# Altium schematic sheet Slave1.SchDoc
size A4; SheetNumber: 5; SheetTotal: 8
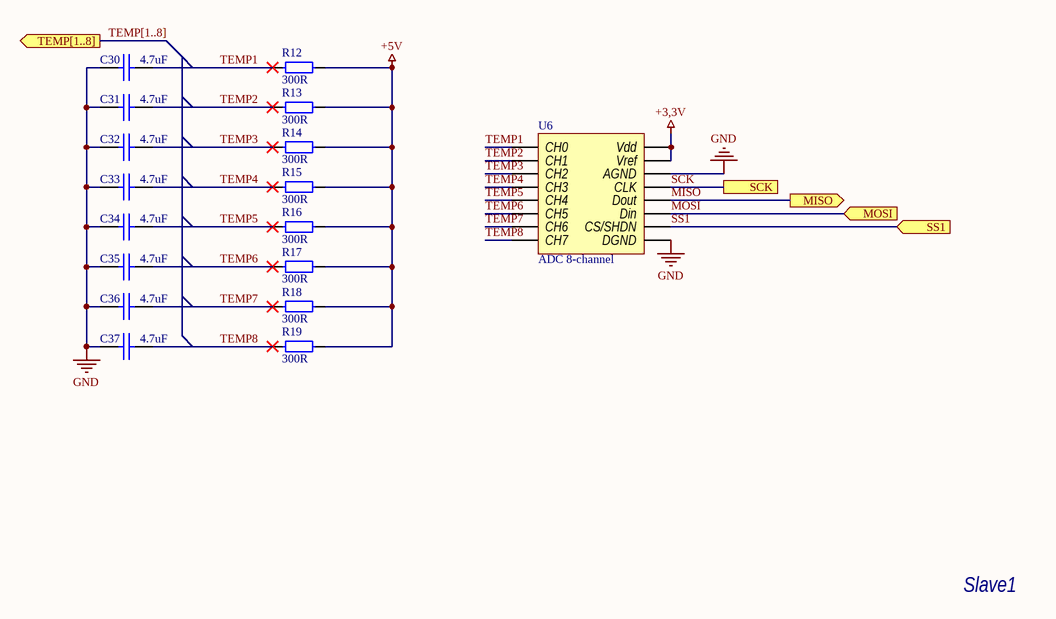
[diagram p0: Slave1.SchDoc]

## Parts
C30  4.7uF  [0603 Capicator]
C31  4.7uF  [0603 Capicator]
C32  4.7uF  [0603 Capicator]
C33  4.7uF  [0603 Capicator]
C34  4.7uF  [0603 Capicator]
C35  4.7uF  [0603 Capicator]
C36  4.7uF  [0603 Capicator]
C37  4.7uF  [0603 Capicator]
R12  300R  [0603 Resistor]
R13  300R  [0603 Resistor]
R14  300R  [0603 Resistor]
R15  300R  [0603 Resistor]
R16  300R  [0603 Resistor]
R17  300R  [0603 Resistor]
R18  300R  [0603 Resistor]
R19  300R  [0603 Resistor]
U6  ADC 8-channel  [SOIC-16]

## Ports
MISO (out), MOSI (in), SCK, SS1 (in), TEMP[1..8] (out)

## Nets
+3,3V: U6.15(Vref) U6.16(Vdd)
+5V: R12.2 R13.2 R14.2 R15.2 R16.2 R17.2 R18.2 R19.2
GND: C30.1 C31.1 C32.1 C33.1 C34.1 C35.1 C36.1 C37.1 U6.9(DGND) U6.14(AGND)
MISO: U6.12(Dout) ; port MISO
MOSI: U6.11(Din) ; port MOSI
SCK: U6.13(CLK) ; port SCK
SS1: U6.10(CS/SHDN) ; port SS1
TEMP1: C30.2 R12.1 U6.1(CH0)
TEMP2: C31.2 R13.1 U6.2(CH1)
TEMP3: C32.2 R14.1 U6.3(CH2)
TEMP4: C33.2 R15.1 U6.4(CH3)
TEMP5: C34.2 R16.1 U6.5(CH4)
TEMP6: C35.2 R17.1 U6.6(CH5)
TEMP7: C36.2 R18.1 U6.7(CH6)
TEMP8: C37.2 R19.1 U6.8(CH7)

## Buses and harness runs
bus TEMP[1..8] = port TEMP[1..8]

## Notes on the sheet
- Slave1

## Library data of the parts
C30-C37 = Cap 4.7uF (0603): 4.7uF X5R 25V 10% 0603; Manufacturer: Murata Manufacturing; Part Number: GRM188R61E475KE11D; Type: Capacitor; ComponentLink1Description: Chip&Dip; ComponentLink1URL: https://www.chipdip.ru/product0/9000348448
R12-R19 = Res 300R (0603): 0.1W 0603 300R, 1%; Part Number: RC0603FR-07360RL; Manufacturer: Taiwan; Type: Resistor; ComponentLink1Description: Chip&Dip; ComponentLink1URL: https://www.chipdip.ru/product0/9000079629
U6 = MCP3008-I/SL: A/D converter with SPI serial interface; Manufacturer: Microchip; Part Number: MCP3008-I/SL; Type: IC; ComponentLink1Description: ChipDip; ComponentLink1URL: https://www.chipdip.ru/product/mcp3008-i-sl; ComponentLink2Description: Datadheet; ComponentLink2URL: https://static.chipdip.ru/lib/527/DOC011527685.pdf